# Altium schematic sheet LEDS - Status.SchDoc
size A4
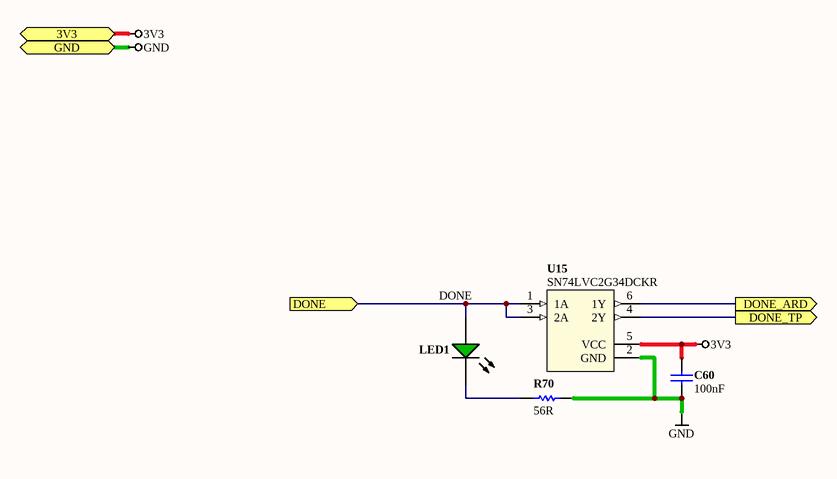
[diagram p0: LEDS - Status.SchDoc]

## Parts
C60  value 100nF  [CAPC0402(1005)60_L]  (hidden comment: CAP 100nF 10V 0402(1005))
LED1  LED_GREEN_APT1608SGC  [LED0603]  (value not drawn)
R70  value 56R  [RESC0402(1005)_L]  (hidden comment: 56R 1% 0402(1005))
U15  SN74LVC2G34DCKR  [TI-DCK6_L]

## Ports
3V3, DONE (in), DONE_ARD (out), DONE_TP (out), GND

## Nets
3V3: C60.2 U15.5(VCC) ; port 3V3
GND: C60.1 R70.2 U15.2(GND) ; port GND
DONE: LED1.1(A) U15.1(1A) U15.3(2A) ; port DONE
DONE_ARD: U15.6(1Y) ; port DONE_ARD
DONE_TP: U15.4(2Y) ; port DONE_TP
NetLED1_2: LED1.2(K) R70.1

## Library data of the parts
C60 = CMP-1034-02064-1: CAP 100nF 10V ±5% 0402 (1005 Metric) Thickness 0.6mm SMD; Case-EIA: 0402; Case-Metric: 1005; Max Thickness: 0.6 mm; Tolerance: ±5%; Rated Voltage: 10 V; Technology: SMT
LED1 = LED_GREEN_APT1608SGC: SMD 0603 LED, GREEN; DefaultDesignator: LED?; Class: Diodes; Forward Voltage (Vf): 2.2V; PartNumber: APT1608SGC; Sub Class: LED; Color: Green
R70 = CMP-1011-00369-1: 56R 0.063W 1% 0402 (1005 Metric)  SMD; Case-Metric: 1005; Case-EIA: 0402; Power: 0.063 W; Tolerance: 1 %; Technology: SMT
U15 = SN74LVC2G34DCKR: IC BUFFER DUAL NON-INV SC706; Manufacturer: Texas Instruments; DefaultDesignator: U?; Class: Logic; Sub Class: Buffer-Line Driver; Description2: IC BUFF/DVR TRI-ST OCTAL 20-VQFN; Logic Type: Buffer/Line Driver, Non-Inverting; Number of Elements: 2; Number of Bits per Element: 4; Current - Output High, Low: 24mA, 24mA; Voltage - Supply: 1.65 V ~ 3.6 V; PartNumber: SN74LVC2G34DCKR; ComponentLink1Description: Datasheet; ComponentLink1URL: http://www.ti.com/lit/ds/symlink/sn74lvc2g34.pdf; ComponentLink2Description: Manufacturer; ComponentLink2URL: www.ti.com; Series: 74LVC; Operating Temperature: -40°C ~ 125°C